# Altium schematic sheet Top.SchDoc
size A4; SheetNumber: 1; SheetTotal: 7
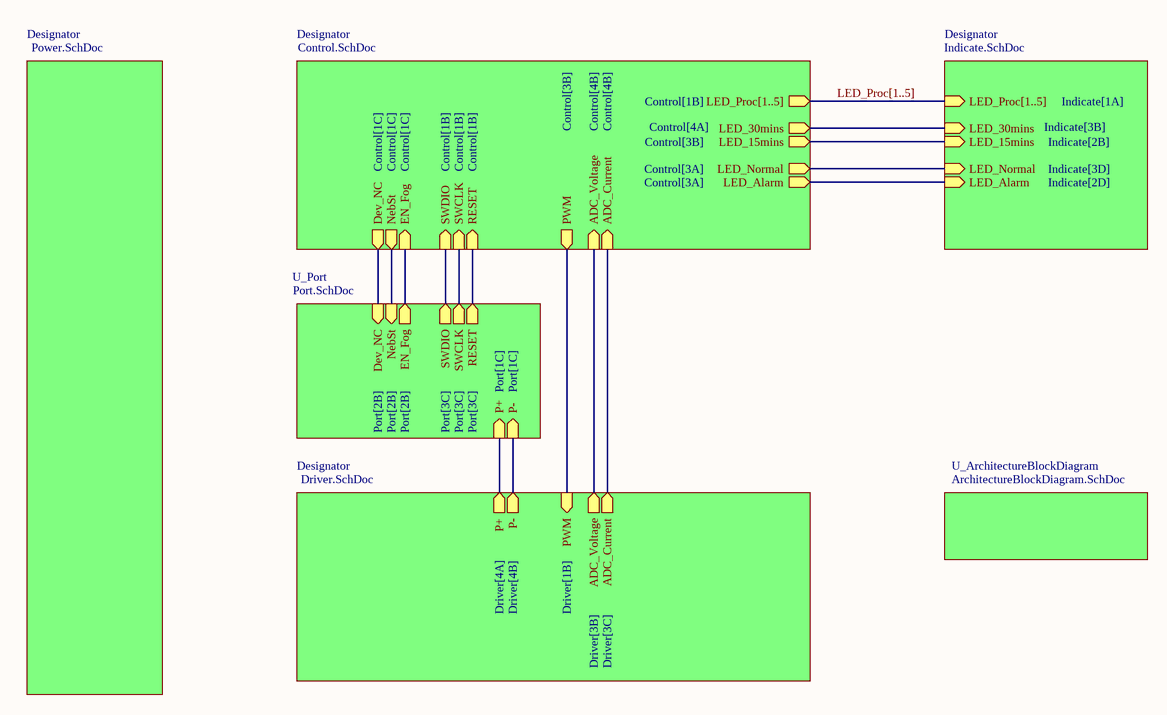
[diagram p0: Top.SchDoc]

## Sub-sheets
Designator = Power.SchDoc: no entries
Designator = Control.SchDoc: LED_30mins (out), LED_Normal (out), LED_15mins (out), PWM (out), ADC_Current (in), ADC_Voltage (in), LED_Alarm (out), Dev_NC (out), NebSt (out), EN_Fog (in), RESET (in), LED_Proc[1..5] (out), SWDIO (in), SWCLK (in)
Designator = Driver.SchDoc: PWM (in), ADC_Current (out), ADC_Voltage (out), P+ (out), P- (out)
Designator = Indicate.SchDoc: LED_Normal (in), LED_30mins (in), LED_15mins (in), LED_Alarm (in), LED_Proc[1..5] (in)
U_ArchitectureBlockDiagram = ArchitectureBlockDiagram.SchDoc: no entries
U_Port = Port.SchDoc: P+ (in), P- (in), Dev_NC (in), NebSt (in), EN_Fog (out), SWCLK (out), SWDIO (out), RESET (out)

## Nets
(unnamed): sheet Designator/LED_30mins, sheet Designator/LED_30mins
(unnamed): sheet Designator/LED_Normal, sheet Designator/LED_Normal
(unnamed): sheet Designator/LED_15mins, sheet Designator/LED_15mins
(unnamed): sheet Designator/PWM, sheet Designator/PWM
(unnamed): sheet Designator/ADC_Current, sheet Designator/ADC_Current
(unnamed): sheet Designator/ADC_Voltage, sheet Designator/ADC_Voltage
(unnamed): sheet Designator/LED_Alarm, sheet Designator/LED_Alarm
(unnamed): sheet Designator/Dev_NC, sheet U_Port/Dev_NC
(unnamed): sheet Designator/NebSt, sheet U_Port/NebSt
(unnamed): sheet Designator/EN_Fog, sheet U_Port/EN_Fog
(unnamed): sheet Designator/RESET, sheet U_Port/RESET
(unnamed): sheet Designator/SWDIO, sheet U_Port/SWDIO
(unnamed): sheet Designator/SWCLK, sheet U_Port/SWCLK
(unnamed): sheet Designator/P+, sheet U_Port/P+
(unnamed): sheet Designator/P-, sheet U_Port/P-

## Buses and harness runs
bus LED_Proc[1..5] = sheet Designator/LED_Proc[1..5]